# Altium schematic sheet MCU-Debug.SchDoc: =ProjectDescription
size 297 x 209 mm; Address1: Address1; Address2: Address2; Address3: Address3; Address4: Address4; SheetNumber: 4; SheetTotal: 7; Scale: 1:1; DocumentType: Схема электрическая принципиальная
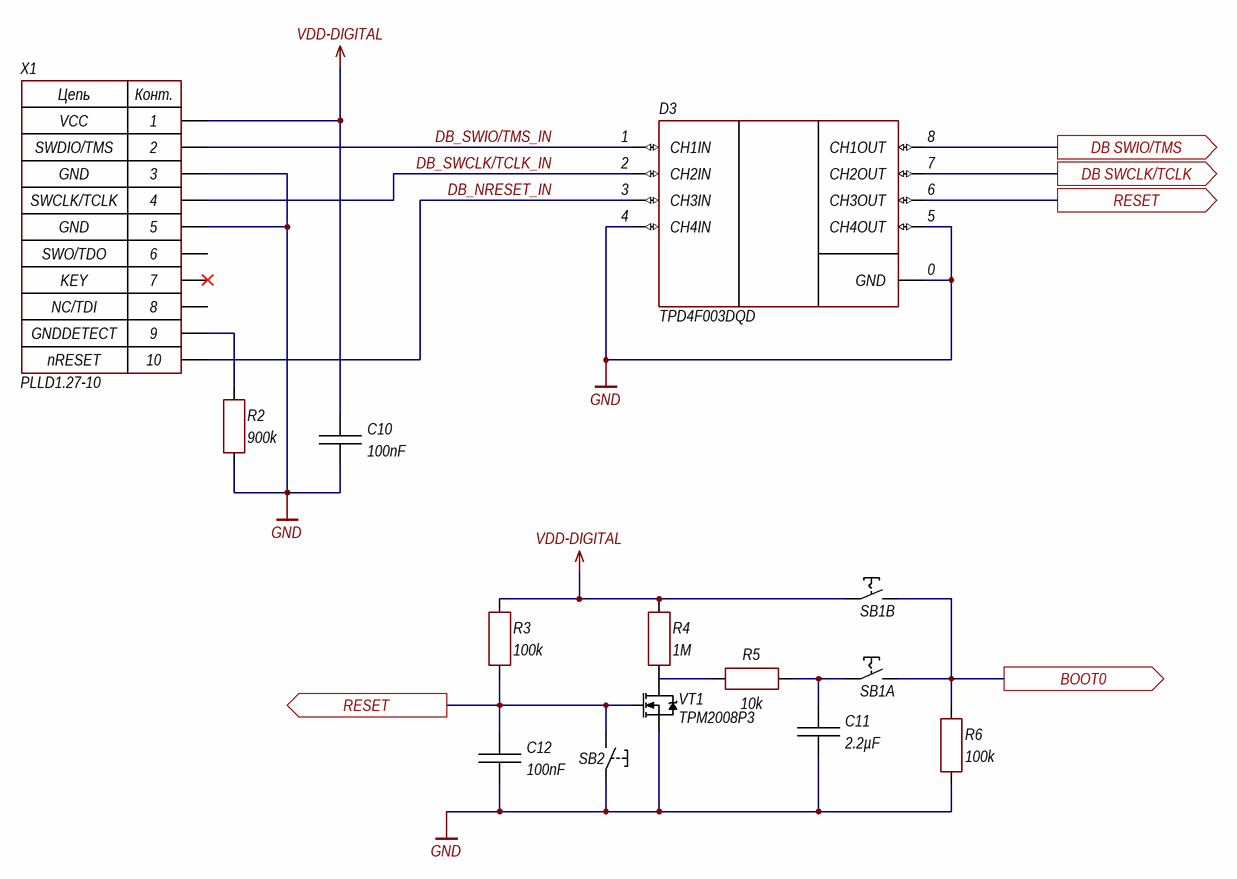
[diagram p0: MCU-Debug.SchDoc]

## Parts
C10  100nF  [CH0402C]
C11  2.2µF  [CH0402C]
C12  100nF  [CH0402C]
D3  TPD4F003DQD  [8-WSON (1.7x1.35 mm)]
R2  900k  [CH0402R]
R3  100k  [CH0402R]
R4  1M  [CH0402R]
R5  10k  [CH0402R]
R6  100k  [CH0402R]
SB1  *  [BUT: DSHP02TS]  (value not drawn)  (parts A,B of 2)
SB2  "Кнопка"  [BUT: YTS-A017]  (value not drawn)
VT1  TPM2008P3  [DFN1006-3L]
X1  PLLD1.27-10  [CON: PLLD-1.27-10]

## Ports
BOOT0 (out), DB SWCLK/TCLK (out), DB SWIO/TMS (out), RESET (out)

## Nets
GND: C10.1 C11.1 C12.1 D3.0(GND) D3.4(CH4IN) D3.5(CH4OUT) R2.1 R6.1 SB2.1 VT1.3(S) X1.3 X1.5
VDD-DIGITAL: C10.2 R3.2 R4.2 SB1.2 X1.1
BOOT0: R6.2 SB1.3 SB1.4 ; port BOOT0
DB SWCLK/TCLK: D3.7(CH2OUT) ; port DB SWCLK/TCLK
DB SWIO/TMS: D3.8(CH1OUT) ; port DB SWIO/TMS
DB_NRESET_IN: D3.3(CH3IN) X1.10
DB_SWCLK/TCLK_IN: D3.2(CH2IN) X1.4
DB_SWIO/TMS_IN: D3.1(CH1IN) X1.2
RESET: C12.2 D3.6(CH3OUT) R3.1 SB2.2 VT1.1(G) ; port RESET
NetC11_2: C11.2 R5.2 SB1.1
NetR2_2: R2.2 X1.9
NetR4_1: R4.1 R5.1 VT1.2(D)

Not connected (* = marked no-connect by the designer): X1 6 7* 8

## Notes on the sheet
- VCC
- SWDIO/TMS
- SWCLK/TCLK
- GND
- SWO/TDO
- KEY
- NC/TDI
- nRESET
- GNDDETECT
- Изм.
- Лист
- № докум.
- Подп.
- Дата
- Копировал
- Формат А4
- (in symbol 10-Connector) Цепь; Конт.

## Library data of the parts
C10-C12 = Capacitor: Manufacturer: *; Model: *; HelpURL: *; ComponentKind: *
  C10 C12: Value: 100nF
  C11: Value: 2.2µF
D3 = TPD4F003: 4-bit IO protection; Manufacturer: Texas Instruments; Model: TPD4F003DQD; ComponentKind: EMI Filter With Integrated ESD Protection; HelpURL: https://www.chipdip.ru/product1/8002950921
R2-R6 = Resistor: Manufacturer: *; Model: *; HelpURL: *; ComponentKind: *
  R2: Value: 900k
  R3 R6: Value: 100k
  R4: Value: 1M
  R5: Value: 10k
SB1 = 2(1)-Switch: 2 Array, latching; Manufacturer: *; Model: *; HelpURL: *; ComponentKind: *
SB2 = 1-Button: Button, no latching; Manufacturer: *; Model: *; HelpURL: *; ComponentKind: *
VT1 = N-chanel: Mosfet; Manufacturer: TECH PUBLIC; Model: TPM2008P3; ComponentKind: 20V, 1.1V, 0.7A; HelpURL: https://www.lcsc.com/product-detail/MOSFETs_TECH-PUBLIC-TPM2008P3_C708974.html
X1 = 10-Connector: Model: PLLD1.27-10; Manufacturer: *; HelpURL: *; ComponentKind: *